# Altium schematic sheet ESP32.SchDoc
size A3; SheetNumber: 3; SheetTotal: 7
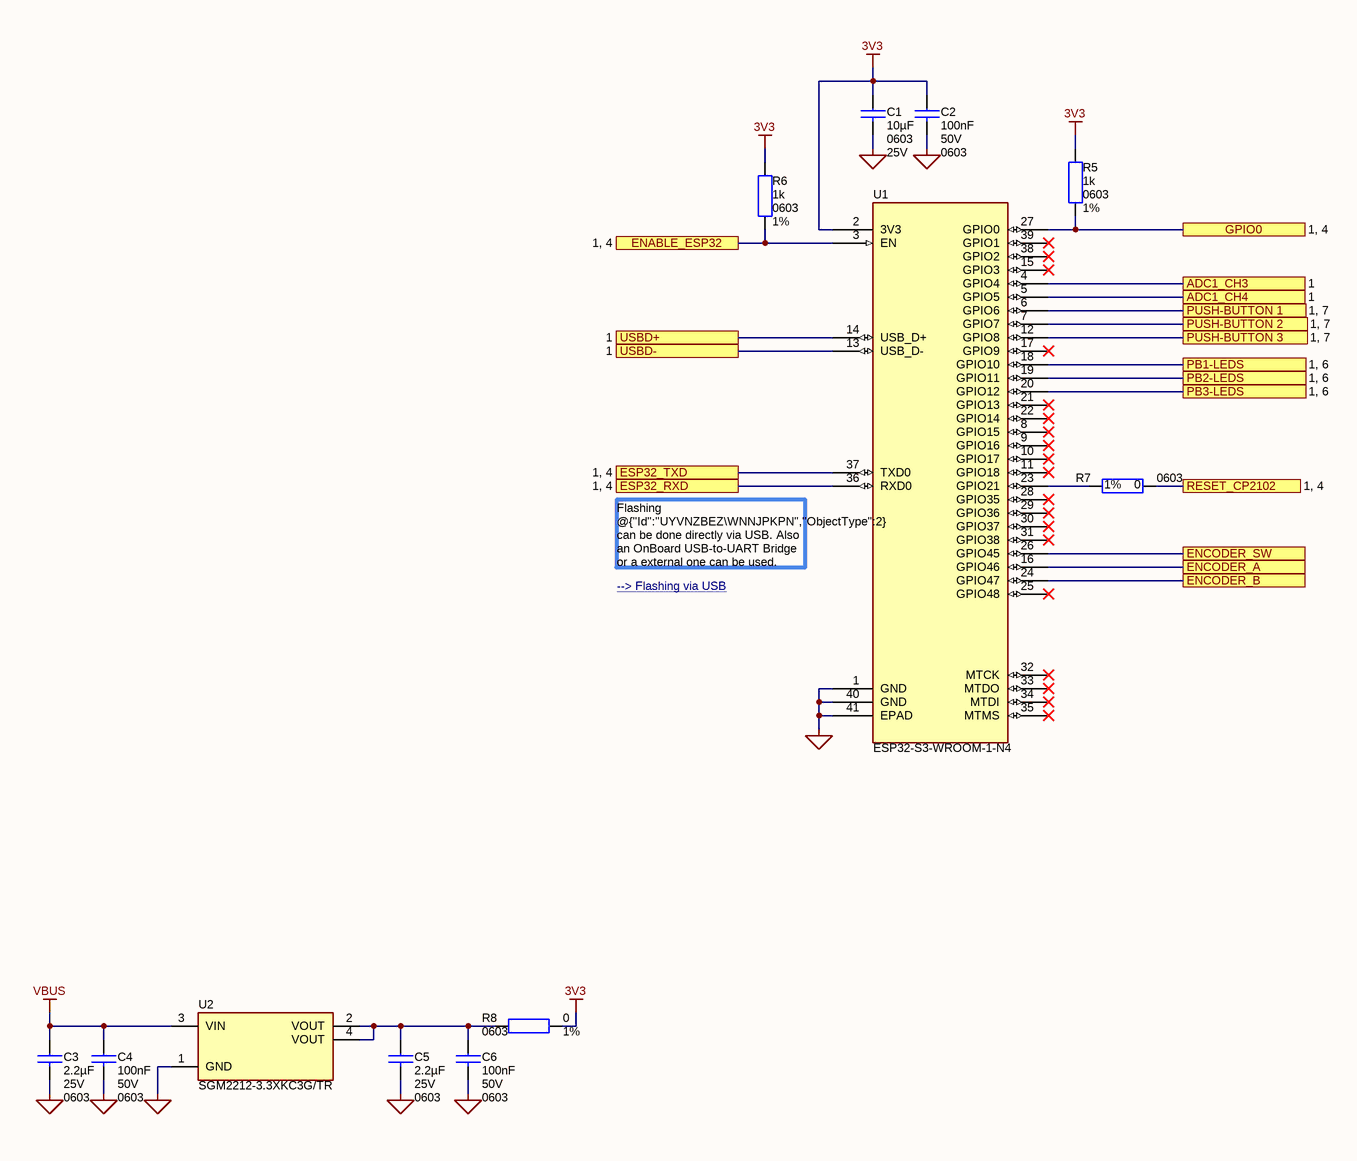
[diagram p0: ESP32.SchDoc]

## Parts
C1  value 10µF  Case/Package: 0603  Voltage: 25V  [CAPC0603X37L]  (hidden comment: GRM188R61E106KA73D)
C2  value 100nF  Voltage: 50V  Case/Package: 0603  [CAPC0603X37L]  (hidden comment: C0603C104K5RACTU)
C3  value 2.2µF  Voltage: 25V  Case/Package: 0603  [CAPC0603X37L]  (hidden comment: GRM188R61E225MA12D)
C4  value 100nF  Voltage: 50V  Case/Package: 0603  [CAPC0603X37L]  (hidden comment: C0603C104K5RACTU)
C5  value 2.2µF  Voltage: 25V  Case/Package: 0603  [CAPC0603X37L]  (hidden comment: GRM188R61E225MA12D)
C6  value 100nF  Voltage: 50V  Case/Package: 0603  [CAPC0603X37L]  (hidden comment: C0603C104K5RACTU)
R5  value 1k  Case/Package: 0603  Tolerance: 1%  [RESC0603X21L]  (hidden comment: RC0603FR-071KL)
R6  value 1k  Case/Package: 0603  Tolerance: 1%  [RESC0603X21L]  (hidden comment: RC0603FR-071KL)
R7  value 0  Case/Package: 0603  Tolerance: 1%  [RESC0603X21L]  (hidden comment: RC0603FR-070RL)
R8  value 0  Case/Package: 0603  Tolerance: 1%  [RESC0603X21L]  (hidden comment: RC0603FR-070RL)
U1  ESP32-S3-WROOM-1-N4  [IC_ESP32-S3-WROOM-1]
U2  SGM2212-3.3XKC3G/TR  [SOT223]

## Ports
ADC1_CH3 (see 1), ADC1_CH4 (see 1), ENABLE_ESP32 (see 1, 4), ENCODER_A, ENCODER_B, ENCODER_SW, ESP32_RXD (see 1, 4), ESP32_TXD (see 1, 4), GPIO0 (see 1, 4), PB1-LEDS (see 1, 6), PB2-LEDS (see 1, 6), PB3-LEDS (see 1, 6), PUSH-BUTTON 1 (see 1, 7), PUSH-BUTTON 2 (see 1, 7), PUSH-BUTTON 3 (see 1, 7), RESET_CP2102 (see 1, 4), USBD+ (see 1), USBD- (see 1)

## Nets
3V3: C1.1 C2.1 R5.1 R6.1 R8.1 U1.2(3V3)
GND: C1.2 C2.2 C3.2 C4.2 C5.2 C6.2 U1.1(GND) U1.40(GND) U1.41(EPAD) U2.1(GND)
VBUS: C3.1 C4.1 U2.3(VIN)
ADC1_CH3: U1.4(GPIO4) ; port ADC1_CH3
ADC1_CH4: U1.5(GPIO5) ; port ADC1_CH4
ENABLE_ESP32: R6.2 U1.3(EN) ; port ENABLE_ESP32
ENCODER_A: U1.16(GPIO46) ; port ENCODER_A
ENCODER_B: U1.24(GPIO47) ; port ENCODER_B
ENCODER_SW: U1.26(GPIO45) ; port ENCODER_SW
ESP32_RXD: U1.36(RXD0) ; port ESP32_RXD
ESP32_TXD: U1.37(TXD0) ; port ESP32_TXD
GPIO0: R5.2 U1.27(GPIO0) ; port GPIO0
PB1-LEDS: U1.18(GPIO10) ; port PB1-LEDS
PB2-LEDS: U1.19(GPIO11) ; port PB2-LEDS
PB3-LEDS: U1.20(GPIO12) ; port PB3-LEDS
PUSH-BUTTON 1: U1.6(GPIO6) ; port PUSH-BUTTON 1
PUSH-BUTTON 2: U1.7(GPIO7) ; port PUSH-BUTTON 2
PUSH-BUTTON 3: U1.12(GPIO8) ; port PUSH-BUTTON 3
RESET_CP2102: R7.2 ; port RESET_CP2102
USBD+: U1.14(USB_D+) ; port USBD+
USBD-: U1.13(USB_D-) ; port USBD-
NetC5_1: C5.1 C6.1 R8.2 U2.2(VOUT) U2.4(VOUT)
NetR7_1: R7.1 U1.23(GPIO21)

Not connected (* = marked no-connect by the designer): U1 8(GPIO15)* 9(GPIO16)* 10(GPIO17)* 11(GPIO18)* 15(GPIO3)* 17(GPIO9)* 21(GPIO13)* 22(GPIO14)* 25(GPIO48)* 28(GPIO35)* 29(GPIO36)* 30(GPIO37)* 31(GPIO38)* 32(MTCK)* 33(MTDO)* 34(MTDI)* 35(MTMS)* 38(GPIO2)* 39(GPIO1)*

## Notes on the sheet
- Flashing @{"Id":"UYVNZBEZ\WNNJPKPN","ObjectType":2} can be done directly via USB. Also an OnBoard USB-to-UART Bridge or a external one can be used.
- --> Flashing via USB <https://docs.espressif.com/projects/esp-idf/en/stable/esp32s3/get-started/establish-serial-connection.html>
- Project
- Schematic Sheet
- EDATRON Solutions GmbH
- Engineering | Training | Consulting
- www.edatron-solutions.com <http://www.edatron-solutions.com>
- Assembly Variant
- Drawn
- Date
- Checked
- Approved
- Project Number
- Customer
- Version/ Revisionindex
- Sheet
- /
- Contact Person
- Name:
- E-Mail:
- Phone:

## Library data of the parts
C1 = CMP-00180-01: CAPACITOR 10 µF 0603 X5R 25V 10%; Manufacturer 1: Murata; Comment Designer: can be substituted same values other manufacturer; Manufacturer 1 Part Number: GRM188R61E106KA73D; Operating Temperature (min): -55°C; Dielectric: X5R; Tolerance: 10%; Operating Temperature (max): 85°C
C2 C4 C6 = CMP-00094-12: CAPACITOR 100 nF 0603 X7R 50V 10%; Manufacturer 1: Kemet; Comment Designer: can be substituted same values other manufacturer; Operating Temperature (max): 125°C; Manufacturer 1 Part Number: C0603C104K5RACTU; Dielectric: X7R; Operating Temperature (min): -55°C; Tolerance: 10%
C3 C5 = CMP-00181-02: CAPACITOR 2.2 µF 0603 X5R 25V 20%; Manufacturer 1 Part Number: GRM188R60J226MEA0D; Manufacturer 1: Murata; Comment Designer: can be substituted same values other manufacturer; Dielectric: X5R; Operating Temperature (min): -55°C; Tolerance: 20%; Operating Temperature (max): 85°C
R5 R6 = CMP-009-00301-12: RESISTOR 1K 1% 0603 100mW; Manufacturer 1: Yageo; Comment Designer: can be substituted same values other manufacturers; Operating Temperature (min): -55°C; Manufacturer 1 Part Number: RC0603FR-071KL; Power: 100mW; Operating Temperature (max): 125°C
R7 R8 = CMP-009-00178-12: RESISTOR 0R 1% 0603 100mW; Manufacturer 1: Yageo; Comment Designer: can be substituted same values other manufacturers; Manufacturer 1 Part Number: RC0603FR-070RL; Power: 100mW; Operating Temperature (min): -55°C; Operating Temperature (max): 125°C
U1 = CMP-020-00023-15: ESP32-S3-WROOM-1-N4 or ESP32-S3-WROOM-1-N4R2 (PSRAM QSPI); Manufacturer 1: Espressif; Memory: 4MB; Operating Temperature (min): -40°C; Storage Temperature (min): -40°C; Operating Temperature (max): 65°C; Manufacturer 1 Part Number: ESP32-S3-WROOM-1-N4; Value: ESP32-S3-WROOM-1; Case/Package: 18 x 25.5 mm; Storage Temperature (max): 150°C
U2 = CMP-00178-03: LDO; Manufacturer 1: SGMICRO; Input Volttage (min): 20V; Input Voltage (max): 2.7V; Current: 800mA; Output Voltage (fixed): 3.3V; Manufacturer 1 Part Number: SGM2212-3.3XKC3G/TR; Operating Temperature (min): -40°C; Operating Temperature (max): 125°C; Value: SGM2212; Case/Package: SOT-223-3